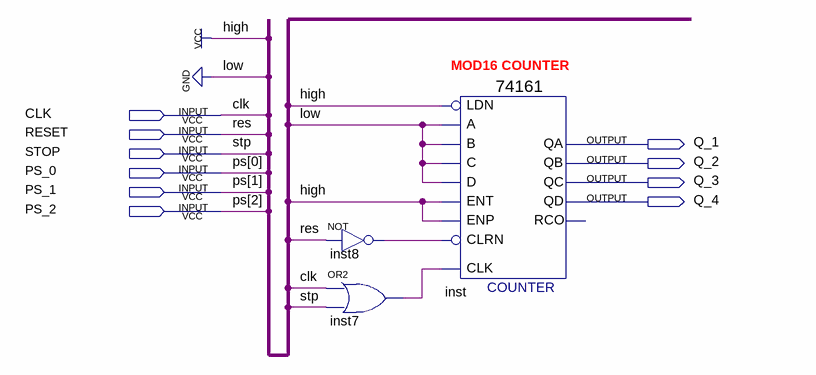
[diagram p0: schematic sheet]
// Quartus schematic TEST_74LS161.bdf as structural Verilog: 3 symbols, 10 pins
module TEST_74LS161 (
  input  CLK,
  input  RESET,
  input  STOP,
  input  PS_0,
  input  PS_1,
  input  PS_2,
  output Q_1,
  output Q_2,
  output Q_3,
  output Q_4
);

  wire inst7_out, inst8_out;

  not inst8 (inst8_out, RESET);
  or inst7 (inst7_out, CLK, STOP);
  \74161  inst (
    .CLRN(inst8_out), .CLK(inst7_out), .ENP(1'b1), .LDN(1'b1), .A(1'b0), .D(1'b0), .ENT(1'b1), .B(1'b0),
    .C(1'b0), .QD(Q_4), .QC(Q_3), .QB(Q_2), .QA(Q_1));  // open: RCO

  // Other names for the same wires on the sheet: ps[2:0] = {PS_2, PS_1, PS_0}; res = RESET; stp = STOP

  // Notes on the sheet:
  //   MOD16 COUNTER
endmodule
